# Altium schematic sheet HV_Side.SchDoc
size A4; SheetNumber: 1; SheetTotal: 8
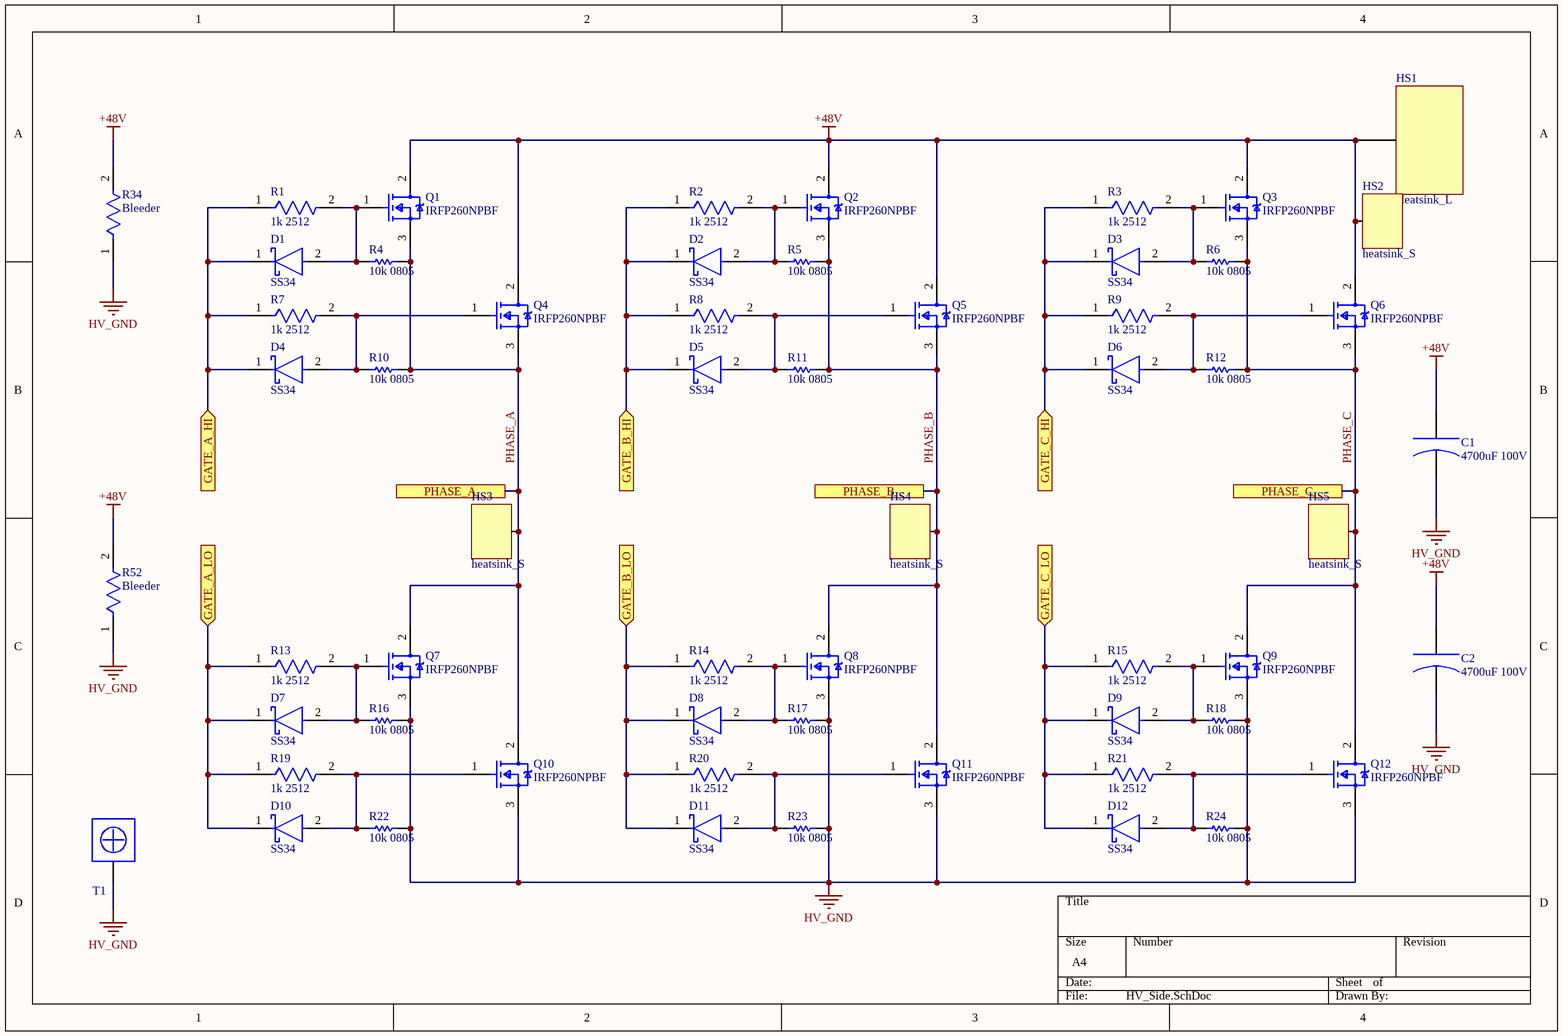
[diagram p0: HV_Side.SchDoc]

## Parts
C1  4700uF 100V  [4700uF 100V]
C2  4700uF 100V  [4700uF 100V]
D1  SS34  [DO-214AC]
D2  SS34  [DO-214AC]
D3  SS34  [DO-214AC]
D4  SS34  [DO-214AC]
D5  SS34  [DO-214AC]
D6  SS34  [DO-214AC]
D7  SS34  [DO-214AC]
D8  SS34  [DO-214AC]
D9  SS34  [DO-214AC]
D10  SS34  [DO-214AC]
D11  SS34  [DO-214AC]
D12  SS34  [DO-214AC]
HS1  Heatsink_L  [heatsink_l]
HS2  heatsink_S  [haetsink_s]
HS3  heatsink_S  [haetsink_s]
HS4  heatsink_S  [haetsink_s]
HS5  heatsink_S  [haetsink_s]
Q1  IRFP260NPBF  [FP-PG-TO247-3-MFG]
Q2  IRFP260NPBF  [FP-PG-TO247-3-MFG]
Q3  IRFP260NPBF  [FP-PG-TO247-3-MFG]
Q4  IRFP260NPBF  [FP-PG-TO247-3-MFG]
Q5  IRFP260NPBF  [FP-PG-TO247-3-MFG]
Q6  IRFP260NPBF  [FP-PG-TO247-3-MFG]
Q7  IRFP260NPBF  [FP-PG-TO247-3-MFG]
Q8  IRFP260NPBF  [FP-PG-TO247-3-MFG]
Q9  IRFP260NPBF  [FP-PG-TO247-3-MFG]
Q10  IRFP260NPBF  [FP-PG-TO247-3-MFG]
Q11  IRFP260NPBF  [FP-PG-TO247-3-MFG]
Q12  IRFP260NPBF  [FP-PG-TO247-3-MFG]
R1  1k 2512  [R2512]
R2  1k 2512  [R2512]
R3  1k 2512  [R2512]
R4  10k 0805  [R0805]
R5  10k 0805  [R0805]
R6  10k 0805  [R0805]
R7  1k 2512  [R2512]
R8  1k 2512  [R2512]
R9  1k 2512  [R2512]
R10  10k 0805  [R0805]
R11  10k 0805  [R0805]
R12  10k 0805  [R0805]
R13  1k 2512  [R2512]
R14  1k 2512  [R2512]
R15  1k 2512  [R2512]
R16  10k 0805  [R0805]
R17  10k 0805  [R0805]
R18  10k 0805  [R0805]
R19  1k 2512  [R2512]
R20  1k 2512  [R2512]
R21  1k 2512  [R2512]
R22  10k 0805  [R0805]
R23  10k 0805  [R0805]
R24  10k 0805  [R0805]
R34  Bleeder  [1W Modified THT]
R52  Bleeder  [1W Modified THT]
T1  7701 Keystone Terminal  [7701 Terminal]  (value not drawn)

## Ports
GATE_A_HI (in), GATE_A_LO (in), GATE_B_HI (in), GATE_B_LO (in), GATE_C_HI (in), GATE_C_LO (in), PHASE_A, PHASE_B, PHASE_C

## Nets
+48V: C1.1(+) C2.1(+) HS1.1 HS2.1 Q1.2(D) Q2.2(D) Q3.2(D) Q4.2(D) Q5.2(D) Q6.2(D) R34.2 R52.2
HV_GND: C1.2(GND) C2.2(GND) Q7.3(S) Q8.3(S) Q9.3(S) Q10.3(S) Q11.3(S) Q12.3(S) R16.2 R17.2 R18.2 R22.2 R23.2 R24.2 R34.1 R52.1 T1.1
GATE_A_HI: D1.1(C) D4.1(C) R1.1 R7.1 ; port GATE_A_HI
GATE_A_LO: D7.1(C) D10.1(C) R13.1 R19.1 ; port GATE_A_LO
GATE_B_HI: D2.1(C) D5.1(C) R2.1 R8.1 ; port GATE_B_HI
GATE_B_LO: D8.1(C) D11.1(C) R14.1 R20.1 ; port GATE_B_LO
GATE_C_HI: D3.1(C) D6.1(C) R3.1 R9.1 ; port GATE_C_HI
GATE_C_LO: D9.1(C) D12.1(C) R15.1 R21.1 ; port GATE_C_LO
PHASE_A: HS3.1 Q1.3(S) Q4.3(S) Q7.2(D) Q10.2(D) R4.2 R10.2 ; port PHASE_A
PHASE_B: HS4.1 Q2.3(S) Q5.3(S) Q8.2(D) Q11.2(D) R5.2 R11.2 ; port PHASE_B
PHASE_C: HS5.1 Q3.3(S) Q6.3(S) Q9.2(D) Q12.2(D) R6.2 R12.2 ; port PHASE_C
NetD1_2: D1.2(A) Q1.1(G) R1.2 R4.1
NetD2_2: D2.2(A) Q2.1(G) R2.2 R5.1
NetD3_2: D3.2(A) Q3.1(G) R3.2 R6.1
NetD4_2: D4.2(A) Q4.1(G) R7.2 R10.1
NetD5_2: D5.2(A) Q5.1(G) R8.2 R11.1
NetD6_2: D6.2(A) Q6.1(G) R9.2 R12.1
NetD7_2: D7.2(A) Q7.1(G) R13.2 R16.1
NetD8_2: D8.2(A) Q8.1(G) R14.2 R17.1
NetD9_2: D9.2(A) Q9.1(G) R15.2 R18.1
NetD10_2: D10.2(A) Q10.1(G) R19.2 R22.1
NetD11_2: D11.2(A) Q11.1(G) R20.2 R23.1
NetD12_2: D12.2(A) Q12.1(G) R21.2 R24.1

## Library data of the parts
C1 C2 = 4700uF 100V: 4700uF 100V Electrolytic Capacitor; Price per piece: 185; ComponentLink1Description: Product URL; ComponentLink1URL: https://sharvielectronics.com/product/4700uf-100v-electrolytic-capacitor/; ComponentLink2Description: Datasheet; ComponentLink2URL: *
D1-D12 = SS34: SS34 SMA 40V/3A Schottky Diode SMD Package-DO-214AC; Manufacturer: Vishay Semiconductors; Manufacturer Part Number: SS34-E3/57T; Max Repetitive Reverse Voltage: 40V; Max Junction Temp: +150°C; Forward Current: 3A; Peak Reverse Current: 0.5mA; Max Surge Forward Current: 100A; Standoff Height: 0mm; ComponentLink2Description: Datasheet; Device Class L3: Schottky Diodes; Height: 2.62mm; Lead Free: Yes; Package: 95402; Temperature Range High: +150°C; ComponentLink2URL: http://www.vishay.com/docs/88751/ss32.pdf; Temperature: -55°C to +150°C; Footprint Url: http://www.vishay.com/docs/95402/smc.pdf; Automotive: No; Category: Diode; RoHS: TRUE; Device Class L2: Diodes; Mouser Description: Schottky Diodes & Rectifiers 3.0 Amp 40 Volt; Octopart: https://octopart.com/ss34-e3%2F57t-vishay-39552907; Temperature Range Low: -55°C; Device Class L1: Discrete Semiconductors; Digikey Description: DIODE SCHOTTKY 40V 3A DO214AB; Price per piece: 5.75; Product URL: https://sharvielectronics.com/product/ss34-sma-40v-3a-schottky-diode-smd-package-do-214ac/; Datasheet: https://drive.google.com/file/d/1NCTjjzsUDglehHYd-VxKcrmaXziByLRA/view?usp=sharing
Q1-Q12 = CMP-32901-000262-1: MOSFET N-CH 200V 50A TO247AC; Drain to Source Resistance: 40mR; Turn-On Delay Time: 17ns; Gate to Source Voltage (Vgs): 20V; Turn-Off Delay Time: 55ns; Max Power Dissipation: 300W; Element Configuration: Single; Input Capacitance: 4.057nF; Threshold Voltage: 4V; Width: 0.209inch; Max Operating Temperature: 175°C; Number of Pins: 3; Lead Free: Lead Free; Rds On Max: 40mR; Case/Package: TO-247; Continuous Drain Current (ID): 50A; Power Dissipation: 300W; RoHS Compliant: Yes; Min Operating Temperature: -55°C; Drain to Source Voltage (Vdss): 200V; Mount: Through Hole; REACH SVHC: No SVHC; Packaging: Bulk; Drain to Source Breakdown Voltage: 200V; Halogen Free: Not Halogen Free; Height: 0.799inch; Length: 0.625inch; Max Dual Supply Voltage: 200V; Price per piece: 110.36
  Q4: ComponentLink1Description: Product URL; ComponentLink1URL: https://sharvielectronics.com/product/irfp260npbf-mosfet-200v-50a-n-channel-power-mosfet-to-247-package/; ComponentLink2Description: Datasheet; ComponentLink2URL: https://drive.google.com/file/d/1_dknK1hQ3iHxK7SVbMXCD2-SqB7tXl_1/view?usp=sharing
R1-R3 R7-R9 R13-R15 R19-R21 = 1K_2512: 1K Ohm 1W Resistor 2512 Package; Manufacturer: Vishay Dale; Manufacturer Part Number: CRCW25121R00FKEG; Resistance: 1R; Tolerance: 1%; Voltage Rating: 500V; Temperature Coefficient: 100ppm/°C; Prie per piece: 3.25; Number of Terminations: 2; Packaging: Tape and Reel; Features: Automotive AEC-Q200; Military Standard: Not; Power Rating: 1W; Max Operating Temperature: 155°C; Number of Pins: 2; Radiation Hardening: No; Mount: Surface Mount; Height: 0.6mm; Max Power Dissipation: 1W; Case Code (Metric): 6432; Termination: SMD/SMT; REACH SVHC: No SVHC; Case/Package: 2512; Weight: 0.001429oz; Package Quantity: 2000; Composition: Thick Film; Voltage Rating (DC): 500V; Width: 0.124inch; Length: 6.3mm; Lead Free: Lead Free; Min Operating Temperature: -55°C; Contact Plating: Tin; Case Code (Imperial): 2512; Depth: 3.15mm; Price per piece: 3.25; ComponentLink1Description: Product URL; ComponentLink1URL: https://sharvielectronics.com/product/1k-ohm-1w-resistor-2512-package-pack-of-5/; ComponentLink2Description: Datasheet; ComponentLink2URL: *; Product URL: https://sharvielectronics.com/product/1k-ohm-1w-resistor-2512-package-pack-of-5/; Datasheet: *
R4-R6 R10-R12 R16-R18 R22-R24 = 10k 0805: 10K Ohm 1/8 Watt Resistor 1% Tolerance RC0805FR-0710KL – 0805 Package; Price per piece: 0.82; Product URL: https://sharvielectronics.com/product/10k-ohm-1-8-watt-resistor-1-tolerance-rc0805fr-0710kl-0805-package/; Datasheet: https://drive.google.com/file/d/1pkLQT_RQ1i35oFQcGREpZr7Oy3Ppi-ZT/view?usp=sharing
R34 R52 = 1W Bleeder